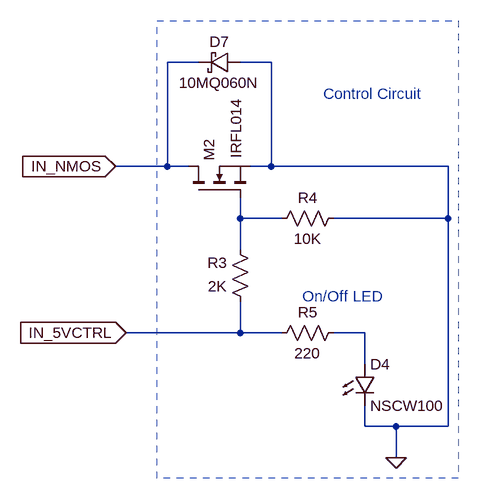
[diagram p0: schematic NMOSControlCircuitModel.asc]
NMOSControlCircuitModel.asc, the LTspice schematic file:
Version 4
SHEET 1 1112 952
WIRE 432 -576 384 -576
WIRE 544 -576 496 -576
WIRE 384 -416 384 -576
WIRE 384 -416 304 -416
WIRE 416 -416 384 -416
WIRE 544 -416 544 -576
WIRE 544 -416 512 -416
WIRE 816 -416 544 -416
WIRE 496 -336 496 -368
WIRE 560 -336 496 -336
WIRE 816 -336 816 -416
WIRE 816 -336 640 -336
WIRE 496 -288 496 -336
WIRE 496 -160 496 -208
WIRE 496 -160 320 -160
WIRE 560 -160 496 -160
WIRE 688 -160 640 -160
WIRE 688 -112 688 -160
WIRE 688 -16 688 -48
WIRE 736 -16 688 -16
WIRE 816 -16 816 -336
WIRE 816 -16 736 -16
WIRE 736 32 736 -16
FLAG 736 32 0
FLAG 304 -416 IN_NMOS
IOPIN 304 -416 In
FLAG 320 -160 IN_5VCTRL
IOPIN 320 -160 In
SYMBOL nmos 416 -368 R270
WINDOW 3 60 74 Left 2
SYMATTR Value IRFL014
SYMATTR InstName M2
SYMBOL res 544 -320 R270
WINDOW 0 32 56 VTop 2
WINDOW 3 0 56 VBottom 2
SYMATTR InstName R4
SYMATTR Value 10K
SYMATTR SpiceLine tol=10 pwr=0.25
SYMBOL res 512 -192 R180
WINDOW 0 36 76 Left 2
WINDOW 3 36 40 Left 2
SYMATTR InstName R3
SYMATTR Value 2K
SYMATTR SpiceLine tol=10 pwr=0.25
SYMBOL LED 672 -112 R0
SYMATTR InstName D4
SYMATTR Value NSCW100
SYMBOL res 544 -144 R270
WINDOW 0 32 56 VTop 2
WINDOW 3 0 56 VBottom 2
SYMATTR InstName R5
SYMATTR Value 220
SYMATTR SpiceLine tol=10 pwr=0.25
SYMBOL schottky 496 -592 R90
WINDOW 0 0 32 VBottom 2
WINDOW 3 32 32 VTop 2
SYMATTR InstName D7
SYMATTR Value 10MQ060N
SYMATTR Description Diode
SYMATTR Type diode
TEXT 624 -528 Left 2 ;Control Circuit
TEXT 592 -216 Left 2 ;On/Off LED
RECTANGLE Normal 832 64 368 -640 2

The netlist it stands for:
* NMOSControlCircuitModel.asc
M2 IN_NMOS N001 0 0 IRFL014
R4 N001 0 10K tol=10 pwr=0.25
R3 IN_5VCTRL N001 2K tol=10 pwr=0.25
D4 N002 0 NSCW100
R5 IN_5VCTRL N002 220 tol=10 pwr=0.25
D7 0 IN_NMOS 10MQ060N
.model D D
.lib standard.dio
.model NMOS NMOS
.model PMOS PMOS
.lib standard.mos
* Control Circuit
* On/Off LED
.backanno
.end